# Altium schematic sheet ONSEMI_MC14504BDR2G.SchDoc
size A4; CompanyName: Technische Hochschule Nürnberg Georg Simon Ohm; Address1: Fürther Straße 250; Address2: 90429 Nürnberg; Address3: GERMANY; DocumentNumber: 6; SheetNumber: 6; SheetTotal: 16; CompanyName2: Institut ELSYS
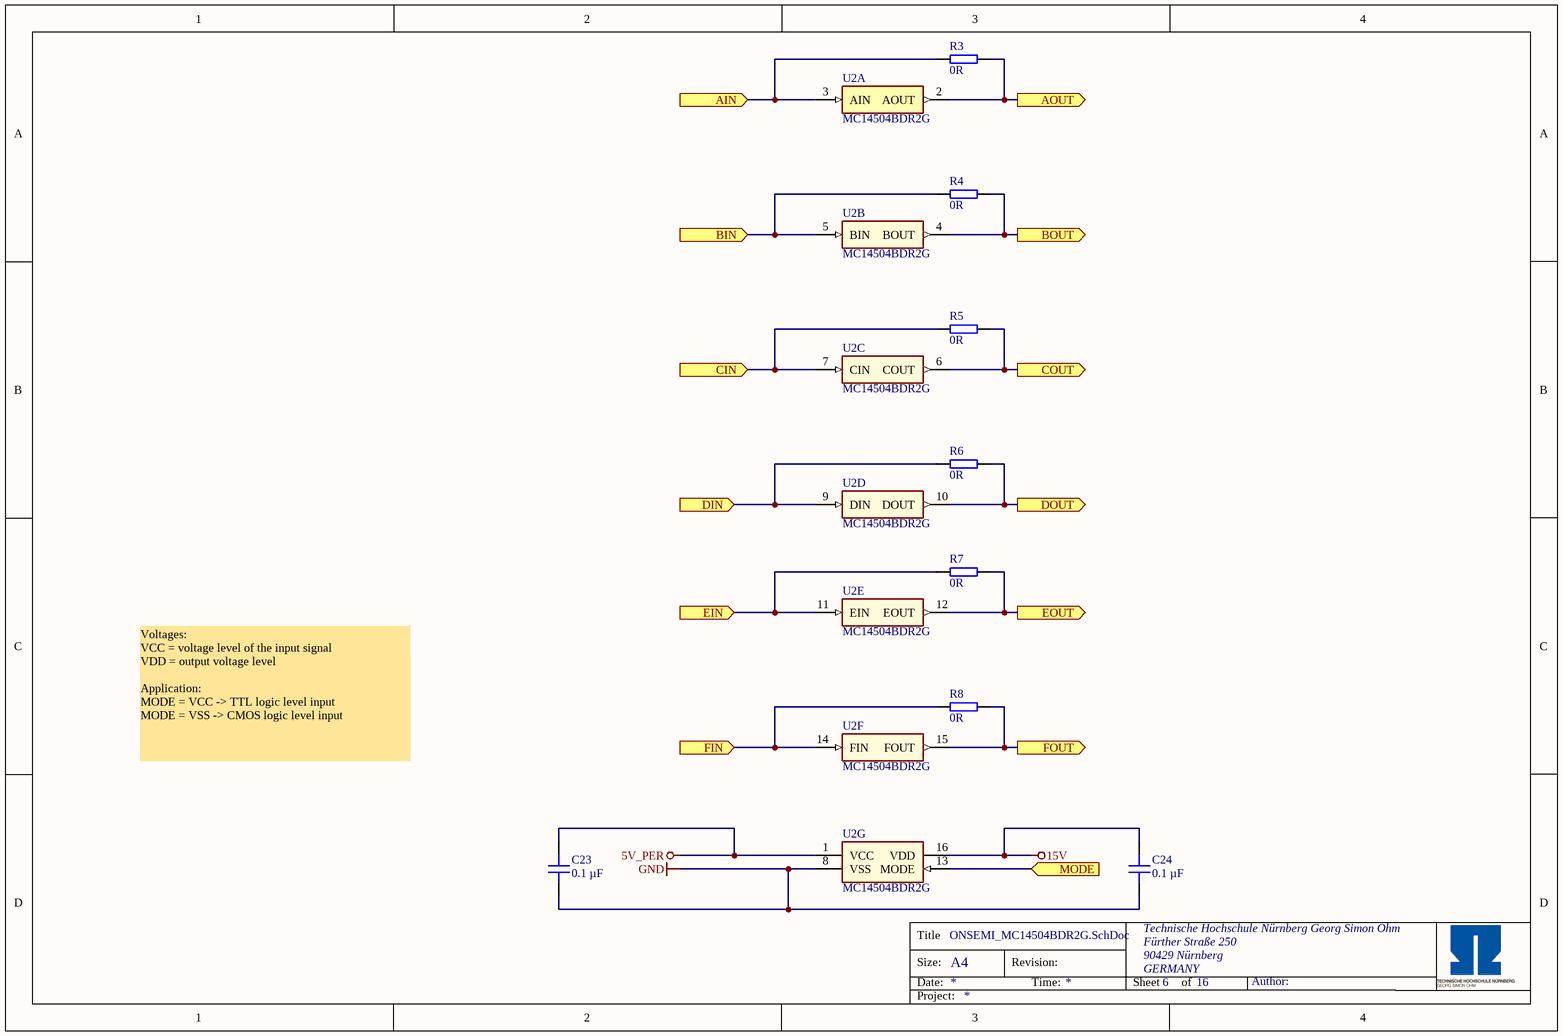
[diagram p0: ONSEMI_MC14504BDR2G.SchDoc]

## Parts
C23  0.1 µF  [C_0603]
C24  0.1 µF  [C_0603]
R3  0R  [RES 0603_1608 NO TO]
R4  0R  [RES 0603_1608 NO TO]
R5  0R  [RES 0603_1608 NO TO]
R6  0R  [RES 0603_1608 NO TO]
R7  0R  [RES 0603_1608 NO TO]
R8  0R  [RES 0603_1608 NO TO]
U2  MC14504BDR2G  [SOIC127P600X175-16N]  (parts A,B,C,D,E,F,G of 7)

## Ports
AIN (in), AOUT (out), BIN (in), BOUT (out), CIN (in), COUT (out), DIN (in), DOUT (out), EIN (in), EOUT (out), FIN (in), FOUT (out), MODE (in)

## Nets
5V_PER: C23.2 U2.1(VCC)
15V: C24.2 U2.16(VDD)
GND: C23.1 C24.1 U2.8(VSS)
AIN: R3.1 U2.3(AIN) ; port AIN
AOUT: R3.2 U2.2(AOUT) ; port AOUT
BIN: R4.1 U2.5(BIN) ; port BIN
BOUT: R4.2 U2.4(BOUT) ; port BOUT
CIN: R5.1 U2.7(CIN) ; port CIN
COUT: R5.2 U2.6(COUT) ; port COUT
DIN: R6.1 U2.9(DIN) ; port DIN
DOUT: R6.2 U2.10(DOUT) ; port DOUT
EIN: R7.1 U2.11(EIN) ; port EIN
EOUT: R7.2 U2.12(EOUT) ; port EOUT
FIN: R8.1 U2.14(FIN) ; port FIN
FOUT: R8.2 U2.15(FOUT) ; port FOUT
MODE: U2.13(MODE) ; port MODE

## Notes on the sheet
- Voltages:
  VCC = voltage level of the input signal
  VDD = output voltage level
  Application:
  MODE = VCC -> TTL logic level input
  MODE = VSS -> CMOS logic level input
- Title
- Size:
- Date:
- A4
- Revision:
- Time:
- Sheet
- of
- Author:
- Project:

## Library data of the parts
C23 C24 = C0603X104K5RAC7411: Capacitor 0603, 50 VDC, 0.1 µF, X7R; Manufacturer: KEMET; Tolerance: 10 %; Voltage Rating: 50 VDC; Created from: MGremer; Manufacturer Part Number: C0603X104K5RAC7411; PartID: 3; Created On: 20.12.2020 13:54:13; ComponentLink1Description: Datasheet; ComponentLink1URL: https://www.mouser.de/datasheet/2/212/1/KEM_C1013_X7R_FT_CAP_SMD-1103280.pdf; Component Type: Capacitor 0603; Device Package: 0603; Last Updated: 04.03.2021 09:24:28; Mounting Type: SMD; Operating Temperature: -55 - 125°C; Series: SMD Comm X7R Flex; Supplier 1: Mouser; Supplier Part Number 1: 80-C0603X104K5R7411; Type: Capacitor; Value: 0.1 µF; Live Cycle Status: 1; Stock number: Labor SMD Container; LCSC Part Number: C14663; Supplier 2: LCSC; Supplier Part Number 2: C14663
R3-R8 = RC0603JR-070RL: SMD resistor E24 series; Manufacturer: YAGEO; Tolerance: 5%; Created from: MGremer; Manufacturer Part Number: RC0603JR-070RL; PartID: 1; Created On: 14.12.2020 16:17:14; ComponentLink1Description: Datasheet; ComponentLink1URL: https://www.mouser.de/datasheet/2/447/PYu-RC_Group_51_RoHS_L_10-1664068.pdf; Component Type: SMD resistor; Device Package: 0603; Last Updated: 04.03.2021 09:09:42; Mounting Type: SMD; Supplier 1: Mouser; Supplier Part Number 1: 603-RC0603JR-070RL; Supplier 2: LCSC; Supplier Part Number 2: C21189; Type: Resistor; Value: 0R; Live Cycle Status: 1; Stock number: Labor SMD Container; LCSC Part Number: C21189
U2 = MC14504BDR2G: Hex Level Shifter for TTL to CMOS or CMOS to CMOS; Manufacturer: ON Semiconductor; Value: 3 - 18 V; Created from: MGremer; Manufacturer Part Number: MC14504BDR2G; PartID: 1; Created On: 18.01.2021 17:03:44; ComponentLink1Description: Datasheet; ComponentLink1URL: https://www.mouser.de/datasheet/2/308/MC14504B-D-1811151.pdf; Component Type: Level Shifter; Device Package: SOIC-16; Last Updated: 04.03.2021 09:27:14; Mounting Type: SMD; Operating Temperature: -55 - 125 °C; Series: MC14504B; Supplier 1: Mouser; Supplier Part Number 1: 863-MC14504BDR2G; Type: Level Shifter; Live Cycle Status: 1; Stock number: not stored; LCSC Part Number: C7291